# Altium schematic sheet STM32F103C8T6MIN-SYS.SchDoc
size A4
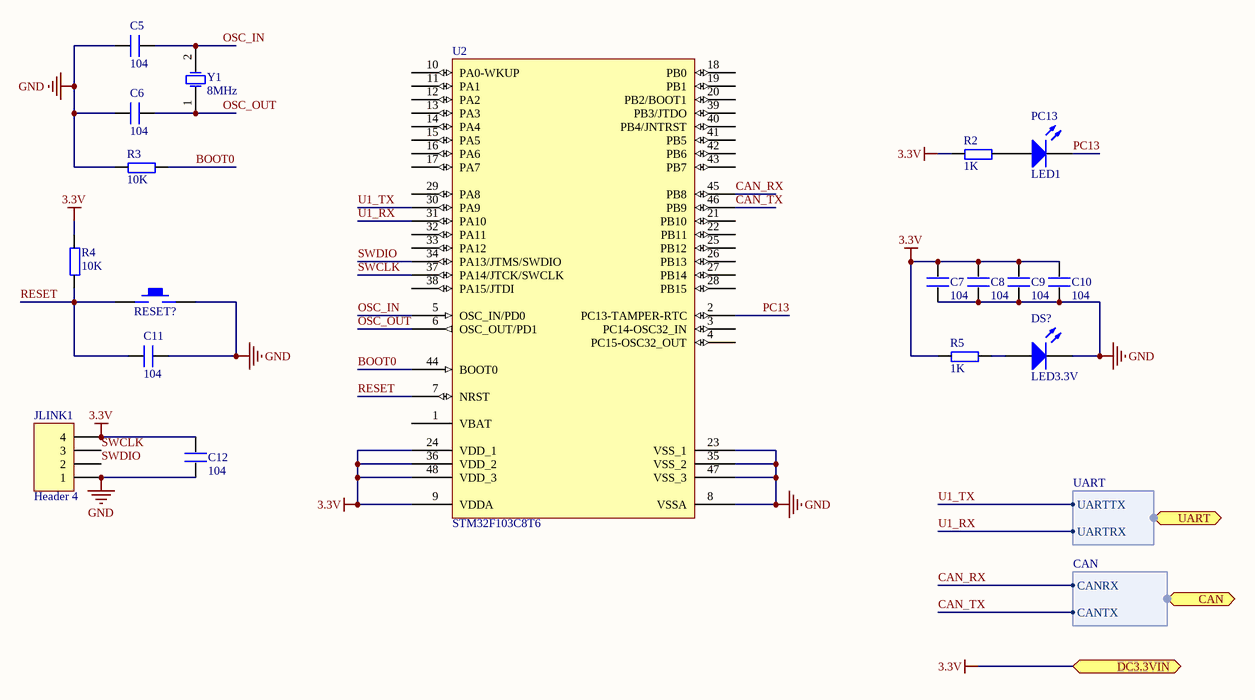
[diagram p0: STM32F103C8T6MIN-SYS.SchDoc]

## Parts
C5  104  [0603P]
C6  104  [0603P]
C7  104  [0603P]
C8  104  [0603P]
C9  104  [0603P]
C10  104  [0603P]
C11  104  [0603P]
C12  104  [0603P]
DS?  LED3.3V  [SMDLED]
JLINK1  Header 4  [HDR1X4]
PC13  LED1  [SMDLED]
R2  1K  [0603P]
R3  10K  [0603P]
R4  10K  [0603P]
R5  1K  [0603P]
RESET?  KEY_M  [KEY_M]  (value not drawn)
U2  STM32F103C8T6  [LQFP48_M]
Y1  8MHz  [XTAL_US]

## Ports
CAN (harness CAN), DC3.3VIN, UART (harness UART)

## Harnesses
UART: UARTTX, UARTRX
CAN: CANRX, CANTX

## Nets
3.3V: C7.2 C8.2 C9.2 C10.2 C12.2 JLINK1.4 R2.1 R4.2 R5.1 U2.9(VDDA) U2.24(VDD_1) U2.36(VDD_2) U2.48(VDD_3) ; port DC3.3VIN
GND: C5.1 C6.1 C7.1 C8.1 C9.1 C10.1 C11.2 C12.1 DS?.2(K) JLINK1.1 R3.1 RESET?.2 U2.8(VSSA) U2.23(VSS_1) U2.35(VSS_2) U2.47(VSS_3)
BOOT0: R3.2 U2.44(BOOT0)
CAN_RX: U2.45(PB8) ; port CAN.CANRX
CAN_TX: U2.46(PB9) ; port CAN.CANTX
OSC_IN: C5.2 U2.5(OSC_IN/PD0) Y1.2(OSC2)
OSC_OUT: C6.2 U2.6(OSC_OUT/PD1) Y1.1(OSC1)
PC13: PC13.2(K) U2.2(PC13-TAMPER-RTC)
RESET: C11.1 R4.1 RESET?.1 U2.7(NRST)
SWCLK: JLINK1.3 U2.37(PA14/JTCK/SWCLK)
SWDIO: JLINK1.2 U2.34(PA13/JTMS/SWDIO)
U1_RX: U2.31(PA10) ; port UART.UARTRX
U1_TX: U2.30(PA9) ; port UART.UARTTX
NetDS?_1: DS?.1(A) R5.2
NetPC13_1: PC13.1(A) R2.2

Not connected (* = marked no-connect by the designer): U2 1(VBAT) 3(PC14-OSC32_IN) 4(PC15-OSC32_OUT) 10(PA0-WKUP) 11(PA1) 12(PA2) 13(PA3) 14(PA4) 15(PA5) 16(PA6) 17(PA7) 18(PB0) 19(PB1) 20(PB2/BOOT1) 21(PB10) 22(PB11) 25(PB12) 26(PB13) 27(PB14) 28(PB15) 29(PA8) 32(PA11) 33(PA12) 38(PA15/JTDI) 39(PB3/JTDO) 40(PB4/JNTRST) 41(PB5) 42(PB6) 43(PB7)

## Library data of the parts
C5-C12 = C
DS? PC13 = LED2: Typical RED, GREEN, YELLOW, AMBER GaAs LED; Published: 8-Jun-2000; LatestRevisionDate: 17-Jul-2002; LatestRevisionNote: Re-released for DXP Platform.; PackageDocument: Feb-2002; PackageReference: 3.2X1.6X1.1; Publisher: Altium Limited
JLINK1 = Header 4: Header, 4-Pin; LatestRevisionDate: 17-Jul-2002; LatestRevisionNote: Re-released for DXP Platform.; Publisher: Altium Limited
R2-R5 = R
U2 = STM32F103C8T6: STM32 ARM-based 32-bit MCU with 64 Kbytes Flash, 48-pin LQFP, Industrial Temperature; Published: 30-May-2008; DatasheetVersion: rev6, Mar-2008; PackageVersion: Mar-2008; PackageReference: LQFP48; Publisher: Altium Limited; PackageDescription: 48-Pin Low-Profile Quad Flat Pack, 7 x 7 mm Body, 0.5 mm Pitch (LQFP48); ComponentLink1Description: Manufacturer Link; ComponentLink1URL: www.st.com/stm32; ComponentLink2Description: Datasheet; ComponentLink2URL: http://www.st.com/stonline/products/literature/ds/13587.pdf
Y1 = XTAL: Crystal Oscillator; Published: 8-Jun-2000; LatestRevisionDate: 17-Jul-2002; LatestRevisionNote: Re-released for DXP Platform.; Publisher: Altium Limited